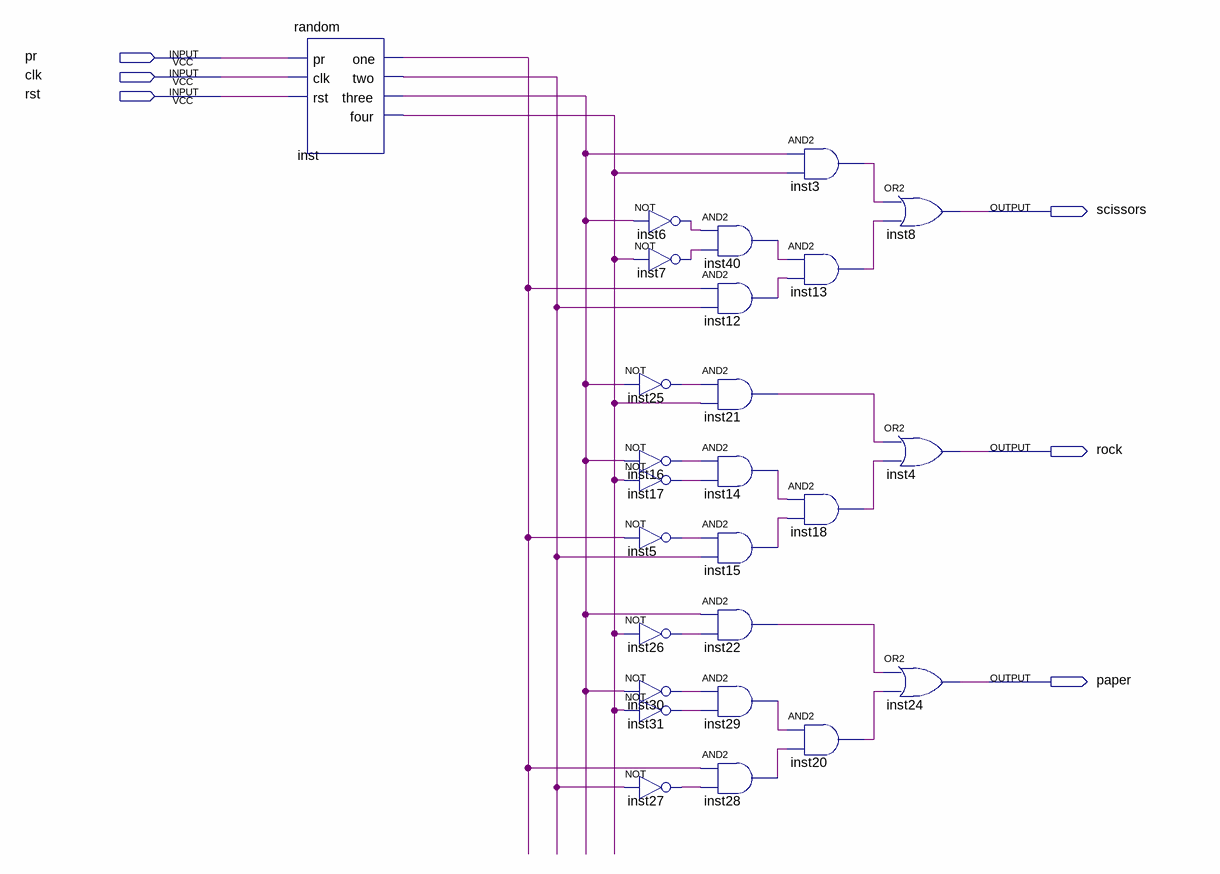
[diagram p0: schematic sheet]
// Quartus schematic rnd1.bdf as structural Verilog: 26 symbols, 6 pins
module rnd1 (
  input  pr,
  input  clk,
  input  rst,
  output scissors,
  output rock,
  output paper
);

  wire inst3_out, inst5_out, inst6_out, inst7_out, inst12_out, inst13_out, inst14_out, inst15_out,
       inst16_out, inst17_out, inst18_out, inst20_out, inst21_out, inst22_out, inst25_out, inst26_out,
       inst27_out, inst28_out, inst29_out, inst30_out, inst31_out, inst40_out, inst_four, inst_one,
       inst_three, inst_two;

  random inst (.pr(pr), .clk(clk), .rst(rst), .one(inst_one), .two(inst_two), .three(inst_three), .four(inst_four));
  not inst6 (inst6_out, inst_three);
  not inst7 (inst7_out, inst_four);
  not inst25 (inst25_out, inst_three);
  not inst16 (inst16_out, inst_three);
  not inst17 (inst17_out, inst_four);
  not inst5 (inst5_out, inst_one);
  not inst26 (inst26_out, inst_four);
  not inst30 (inst30_out, inst_three);
  not inst31 (inst31_out, inst_four);
  not inst27 (inst27_out, inst_two);
  and inst40 (inst40_out, inst6_out, inst7_out);
  and inst12 (inst12_out, inst_one, inst_two);
  and inst21 (inst21_out, inst25_out, inst_four);
  and inst14 (inst14_out, inst16_out, inst17_out);
  and inst15 (inst15_out, inst5_out, inst_two);
  and inst22 (inst22_out, inst_three, inst26_out);
  and inst29 (inst29_out, inst30_out, inst31_out);
  and inst28 (inst28_out, inst_one, inst27_out);
  and inst3 (inst3_out, inst_three, inst_four);
  and inst13 (inst13_out, inst40_out, inst12_out);
  and inst18 (inst18_out, inst14_out, inst15_out);
  and inst20 (inst20_out, inst29_out, inst28_out);
  or inst8 (scissors, inst3_out, inst13_out);
  or inst4 (rock, inst21_out, inst18_out);
  or inst24 (paper, inst22_out, inst20_out);
endmodule
